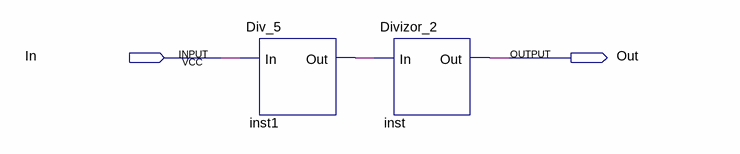
[diagram p0: schematic sheet]
// Quartus schematic Div_10.bdf as structural Verilog: 2 symbols, 2 pins
module Div_10 (
  input  In,
  output Out
);

  wire inst1_out;

  Div_5 inst1 (.In(In), .Out(inst1_out));
  Divizor_2 inst (.In(inst1_out), .Out(Out));
endmodule
